# EAGLE design Codeshelf-0011.v01 (EAGLE 6.5.0)
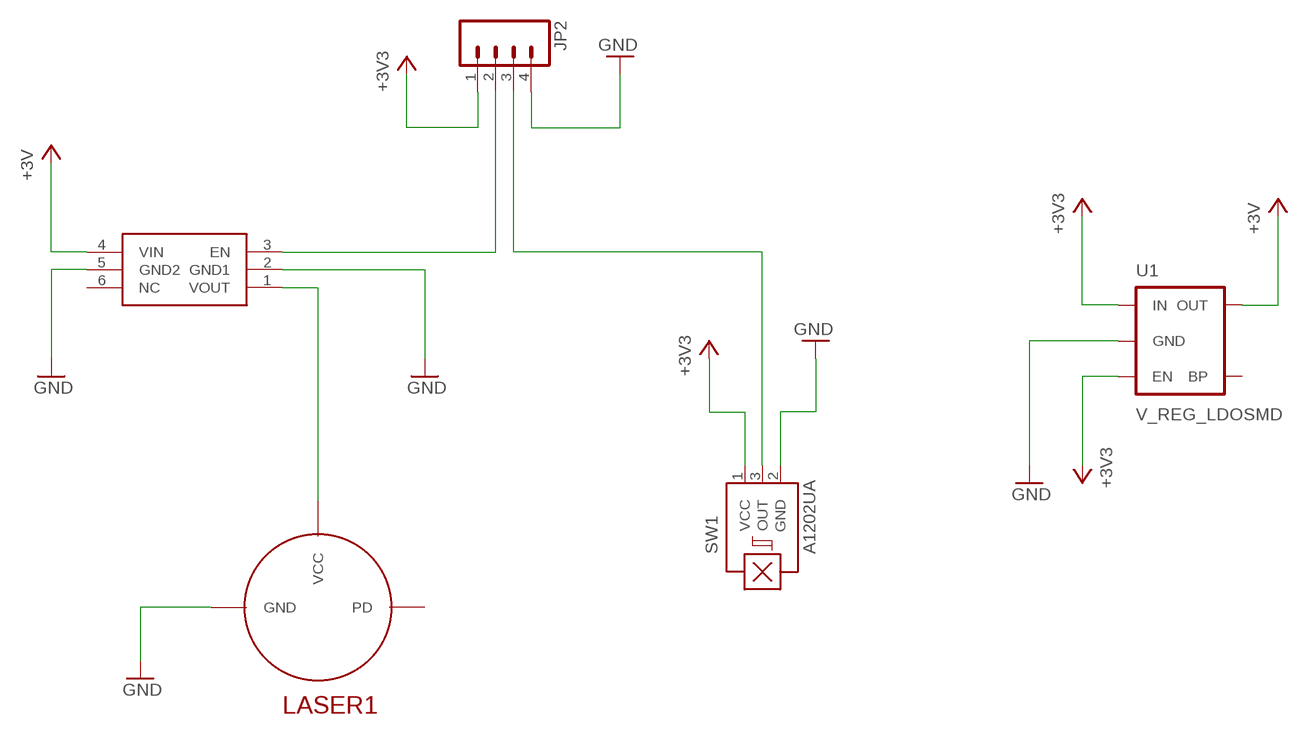
[diagram p0: schematic, sheet 1]

## Parts
JP2  M04PTH  [1X04]
LASER1  LMAPCD-650-06  [LMAPCD-650-06]
SW1  A1202UA  [SIP3-UA]
U1  V_REG_LDOSMD  [SOT23-5]
U2  MIC94061C6  [SC70-6L]

## Nets
+3V [LASER]: U1.5(OUT) U2.4(VIN)
+3V3 [3v3]: JP2.1 SW1.1(VCC) U1.1(IN) U1.3(EN)
GND [GND]: JP2.4 LASER1.1(GND) SW1.2(GND) U1.2(GND) U2.2(GND1) U2.5(GND2)
N$2: JP2.2 U2.3(EN)
N$3: JP2.3 SW1.3(OUT)
VCC [LASER]: LASER1.2(VCC) U2.1(VOUT)
Unconnected: LASER1.3(PD) U1.4(BP) U2.6(NC)

## Library data of the parts
JP2 = SparkFun:M04: Header 4 Standard 4-pin 0.1" header. Use with straight break away headers (SKU : PRT-00116), right angle break away headers (PRT-00553), swiss pins (PRT-00743), machine pins (PRT-00117), and female headers (PRT-00115). Molex polarized connector foot print use with SKU : PRT-08231 with associated crimp pins and housings.
LASER1 = GW-devices:LMAPCD-650-06
SW1 = allegro:A12*?: Hall-effect bipolar switch Source: http://www.allegromicro.com/en/Products/Part_Numbers/1202/1202.pdf; MFGN: Honeywell; MFGP: SS441R; OC_FARNELL: unknown; OC_NEWARK: unknown; PRICE: 1.00
U1 = SparkFun:V_REG_LDO: Voltage Regulator LDO Standard 150mA LDO voltage regulator in SOT-23 layout. Micrel part MIC5205. BP (by-pass) pin is used to lower output noise with 470pF cap.; MFGN: Diodes Ince; MFGP: AP7331-28WG-7; PRICE: 0.50
U2 = GW-devices:MIC94061; MFGN: Micrel; MFGP: MIC94061YC6 TR; PRICE: 1.50

## Net classes
1 3v3: width 0.5 mm
2 12V: width 1 mm
3 LASER: width 0.5 mm
4 GND: width 0.5 mm
5 RS485: width 0.4 mm

## Board
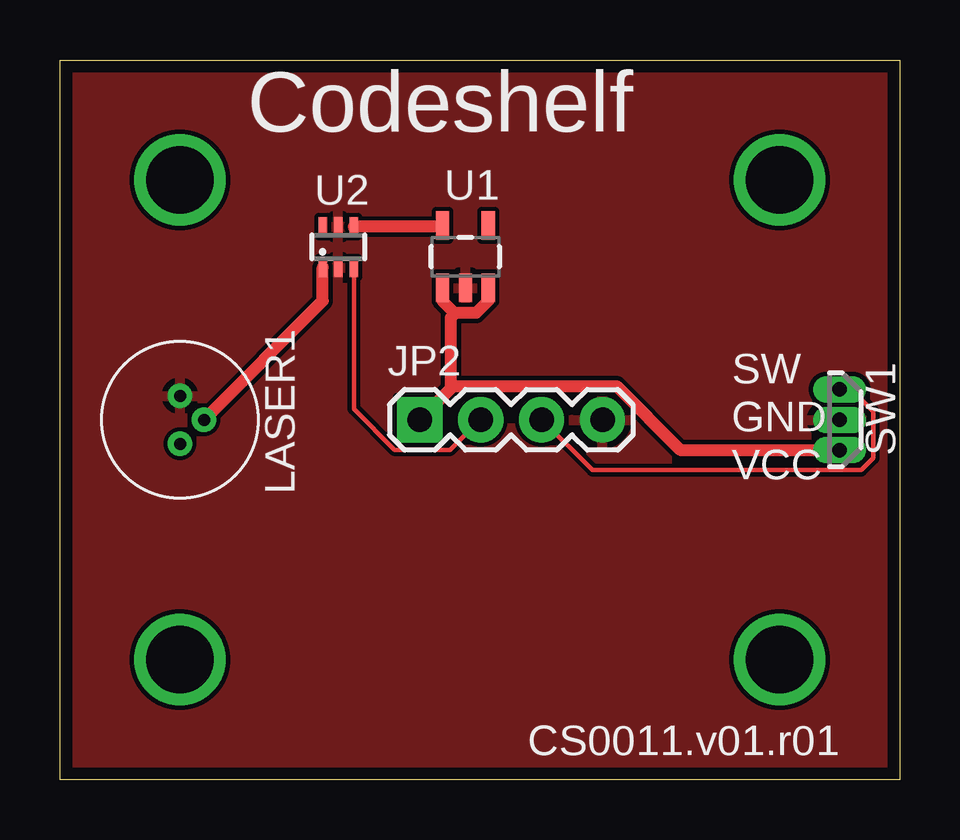
[diagram p1: board, top side]
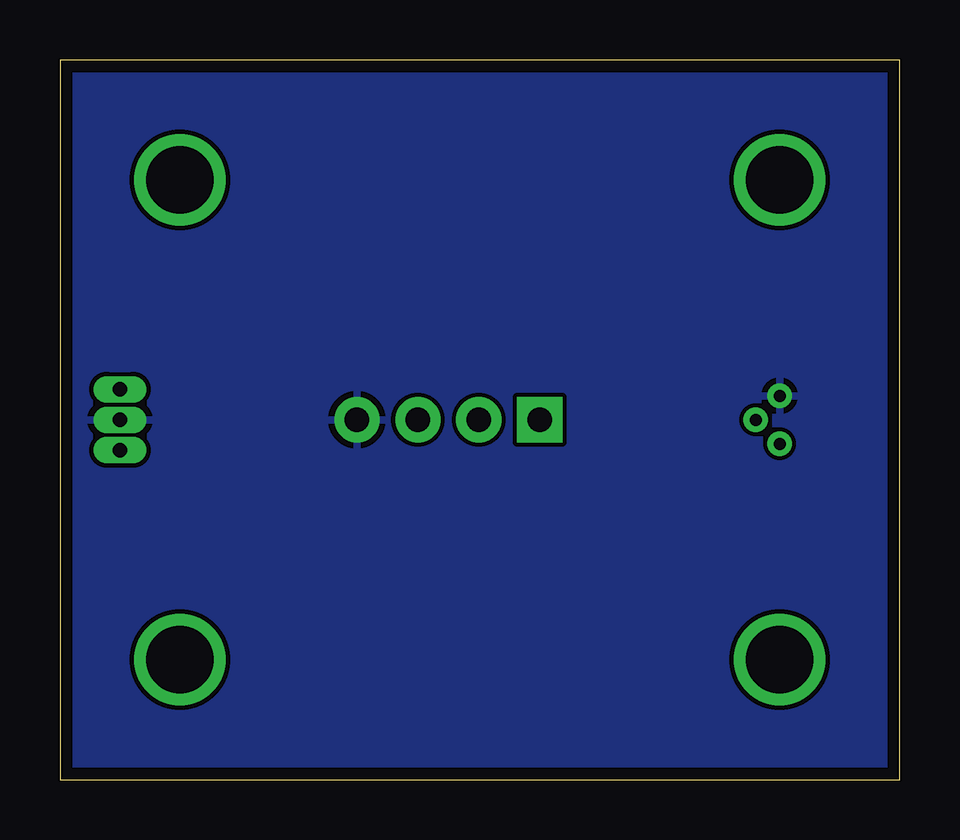
[diagram p2: board, bottom side, seen from below]

Size 35 x 30 mm. Coordinates in mm from the lower left corner, seen from the top.
Outline: 0,0 0,30 35,30 35,0 0,0
Copper layers (1*16): Top 0.0356mm / dielectric 1.5011mm / Bottom 0.0356mm
Design rules "SilverCircuits": minimum track width 7mil, minimum drill 14mil, track to track 7mil, track to pad 7mil, pad to pad 7mil, via to via 7mil, smd to smd 0mil, copper to edge 20mil, drill to drill 8mil, minimum pad ring 10mil, minimum via ring 8mil, stop-mask expansion 4mil, vias tented up to drill 0mil, thermal gap 10mil

### Footprints (pad centres in the part's own frame; a part is rotated, then mirrored left to right if it is on the bottom)
1X04 = drill 1.016 pad 1.88 square: 1 0,0 | drill 1.016 pad 1.88: 2 2.54,0; 3 5.08,0; 4 7.62,0
LMAPCD-650-06 = drill 0.5: 1 -1,0; 2 0,1; 3 1,0
SIP3-UA = drill 0.6 pad 0.7 long: 1 -1.27,0; 2 0,0; 3 1.27,0
SOT23-5 = smd 0.55 x 1.2: 1 -0.95,-1.3; 2 0,-1.3; 3 0.95,-1.3; 4 0.95,1.3; 5 -0.95,1.3
SC70-6L = smd 0.35 x 0.8: 1 -0.65,-0.85; 2 0,-0.85; 3 0.65,-0.85; 4 0.65,0.85; 5 0,0.85; 6 -0.65,0.85

### Placement (x,y rotation side)
JP2  15,15 0 top
LASER1  5,15 270 top
SW1  32.5,15 90 top
U1  16.9,21.8 0 top
U2  11.6,22.2 0 top

### Tracks (layer width: path | path; a pad name or v marks a point on that pad's centre or on a via)
+3V
  Top 0.5: U2.4 15.9,23.05 U1.5 | U1.5
+3V3
  Top 0.5: U1.1 15.95,19.95 16.45,19.45 | 16.45,19.45 17.35,19.45 17.85,19.95 U1.3 | 16.3,16.4 16.3,16.3 JP2.1 | 16.3,16.4 16.3,19.25 16.45,19.45 | 16.3,16.4 23.2,16.4 25.85,13.75 32.5,13.75 SW1.1
GND
  pour Bottom: 0,0 0,30 35,30 35,0
  pour Top: 0,0 0,30 35,30 35,0
N$2
  Top 0.178: U2.3 12.25,15.45 13.95,13.75 16.25,13.75 17.5,15 JP2.2
N$3
  Top 0.178: SW1.3 32.5,16.25 33,16.25 33.9,15.35 33.9,13.4 33.4,12.9 22.2,12.9 20.1,15 JP2.3
N$5  (via drill 2.8)
  other vias: 5,5
N$9  (via drill 2.8)
  other vias: 30,5
N$21  (via drill 2.8)
  other vias: 5,25
N$27  (via drill 2.8)
  other vias: 30,25
VCC
  Top 0.5: U2.1 10.95,19.95 LASER1.2

### Text on the board
tPlace: Codeshelf | SW | GND | VCC | CS0011.v01.r01